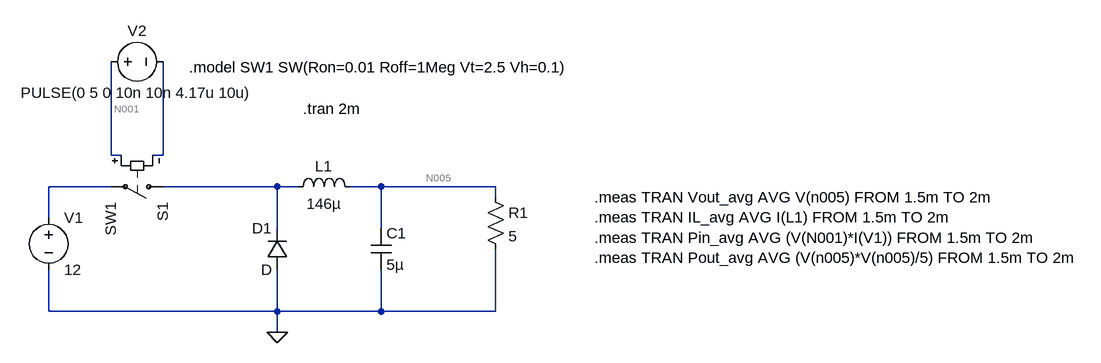
[diagram p0: schematic buckconvertor.asc]
buckconvertor.asc, the LTspice schematic file:
Version 4.1
SHEET 1 1300 680
WIRE -240 -16 -240 -160
WIRE -224 -16 -240 -16
WIRE -160 -16 -160 -160
WIRE -160 -16 -176 -16
WIRE -240 32 -336 32
WIRE 16 32 -160 32
WIRE 48 32 16 32
WIRE 176 32 128 32
WIRE 352 32 176 32
WIRE 352 48 352 32
WIRE -336 80 -336 32
WIRE 16 96 16 32
WIRE 176 96 176 32
WIRE -336 224 -336 160
WIRE 16 224 16 160
WIRE 16 224 -336 224
WIRE 176 224 176 160
WIRE 176 224 16 224
WIRE 352 224 352 128
WIRE 352 224 176 224
WIRE 16 256 16 224
FLAG 16 256 0
SYMBOL cap 160 96 R0
SYMATTR InstName C1
SYMATTR Value 5µ
SYMBOL diode 32 160 R180
WINDOW 0 24 64 Left 2
WINDOW 3 24 0 Left 2
SYMATTR InstName D1
SYMBOL ind 32 48 R270
WINDOW 0 32 56 VTop 2
WINDOW 3 5 56 VBottom 2
SYMATTR InstName L1
SYMATTR Value 146µ
SYMATTR SpiceLine Rser=1m
SYMBOL res 336 32 R0
SYMATTR InstName R1
SYMATTR Value 5
SYMBOL sw -144 32 R90
SYMATTR InstName S1
SYMATTR Value SW1
SYMBOL voltage -336 64 R0
WINDOW 123 0 0 Left 0
WINDOW 39 0 0 Left 0
SYMATTR InstName V1
SYMATTR Value 12
SYMBOL voltage -256 -160 R270
WINDOW 0 32 56 VTop 2
WINDOW 3 -32 56 VBottom 2
WINDOW 123 0 0 Left 0
WINDOW 39 0 0 Left 0
SYMATTR InstName V2
SYMATTR Value PULSE(0 5 0 10n 10n 4.17u 10u)
TEXT -120 -152 Left 2 !.model SW1 SW(Ron=0.01 Roff=1Meg Vt=2.5 Vh=0.1)
TEXT 56 -88 Left 2 !.tran 2m
TEXT 504 48 Left 2 !.meas TRAN Vout_avg AVG V(n005) FROM 1.5m TO 2m\n.meas TRAN IL_avg AVG I(L1) FROM 1.5m TO 2m\n.meas TRAN Pin_avg AVG (V(N001)*I(V1)) FROM 1.5m TO 2m\n.meas TRAN Pout_avg AVG (V(n005)*V(n005)/5) FROM 1.5m TO 2m

The netlist it stands for:
* buckconvertor.asc
C1 N005 0 5µ
D1 0 N004 D
L1 N004 N005 146µ Rser=1m
R1 N005 0 5
S1 N004 N003 N001 N002 SW1
V1 N003 0 12
V2 N001 N002 PULSE(0 5 0 10n 10n 4.17u 10u)
.model D D
.lib standard.dio
.model SW1 SW(Ron=0.01 Roff=1Meg Vt=2.5 Vh=0.1)
.tran 2m
.meas TRAN Vout_avg AVG V(n005) FROM 1.5m TO 2m
.meas TRAN IL_avg AVG I(L1) FROM 1.5m TO 2m
.meas TRAN Pin_avg AVG (V(N001)*I(V1)) FROM 1.5m TO 2m
.meas TRAN Pout_avg AVG (V(n005)*V(n005)/5) FROM 1.5m TO 2m
.backanno
.end